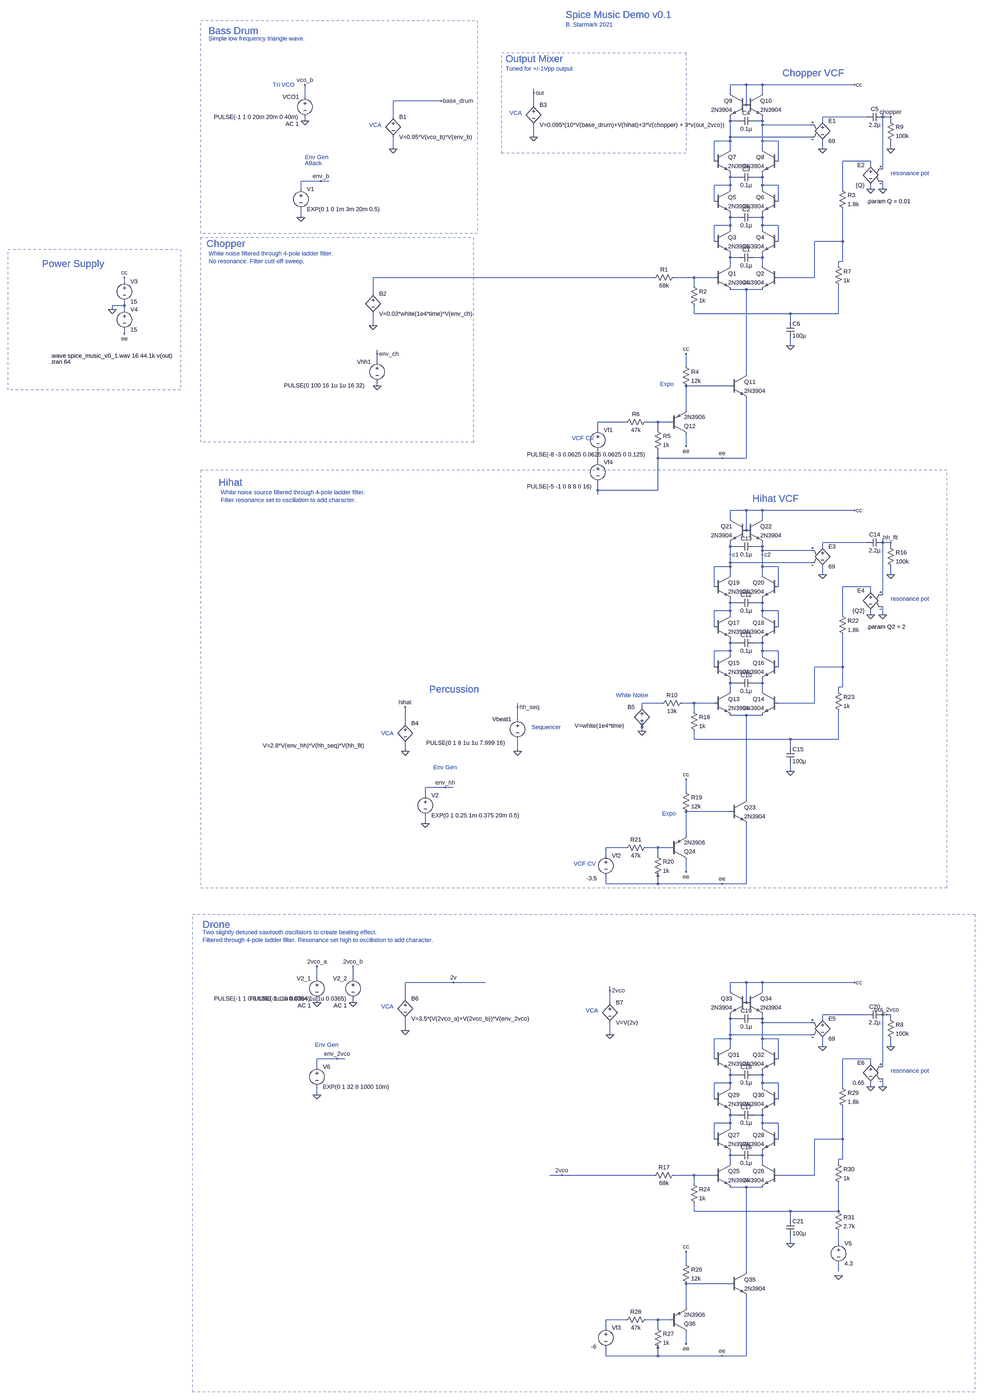
[diagram p0: schematic spice_music_v0_1.asc, whole sheet]
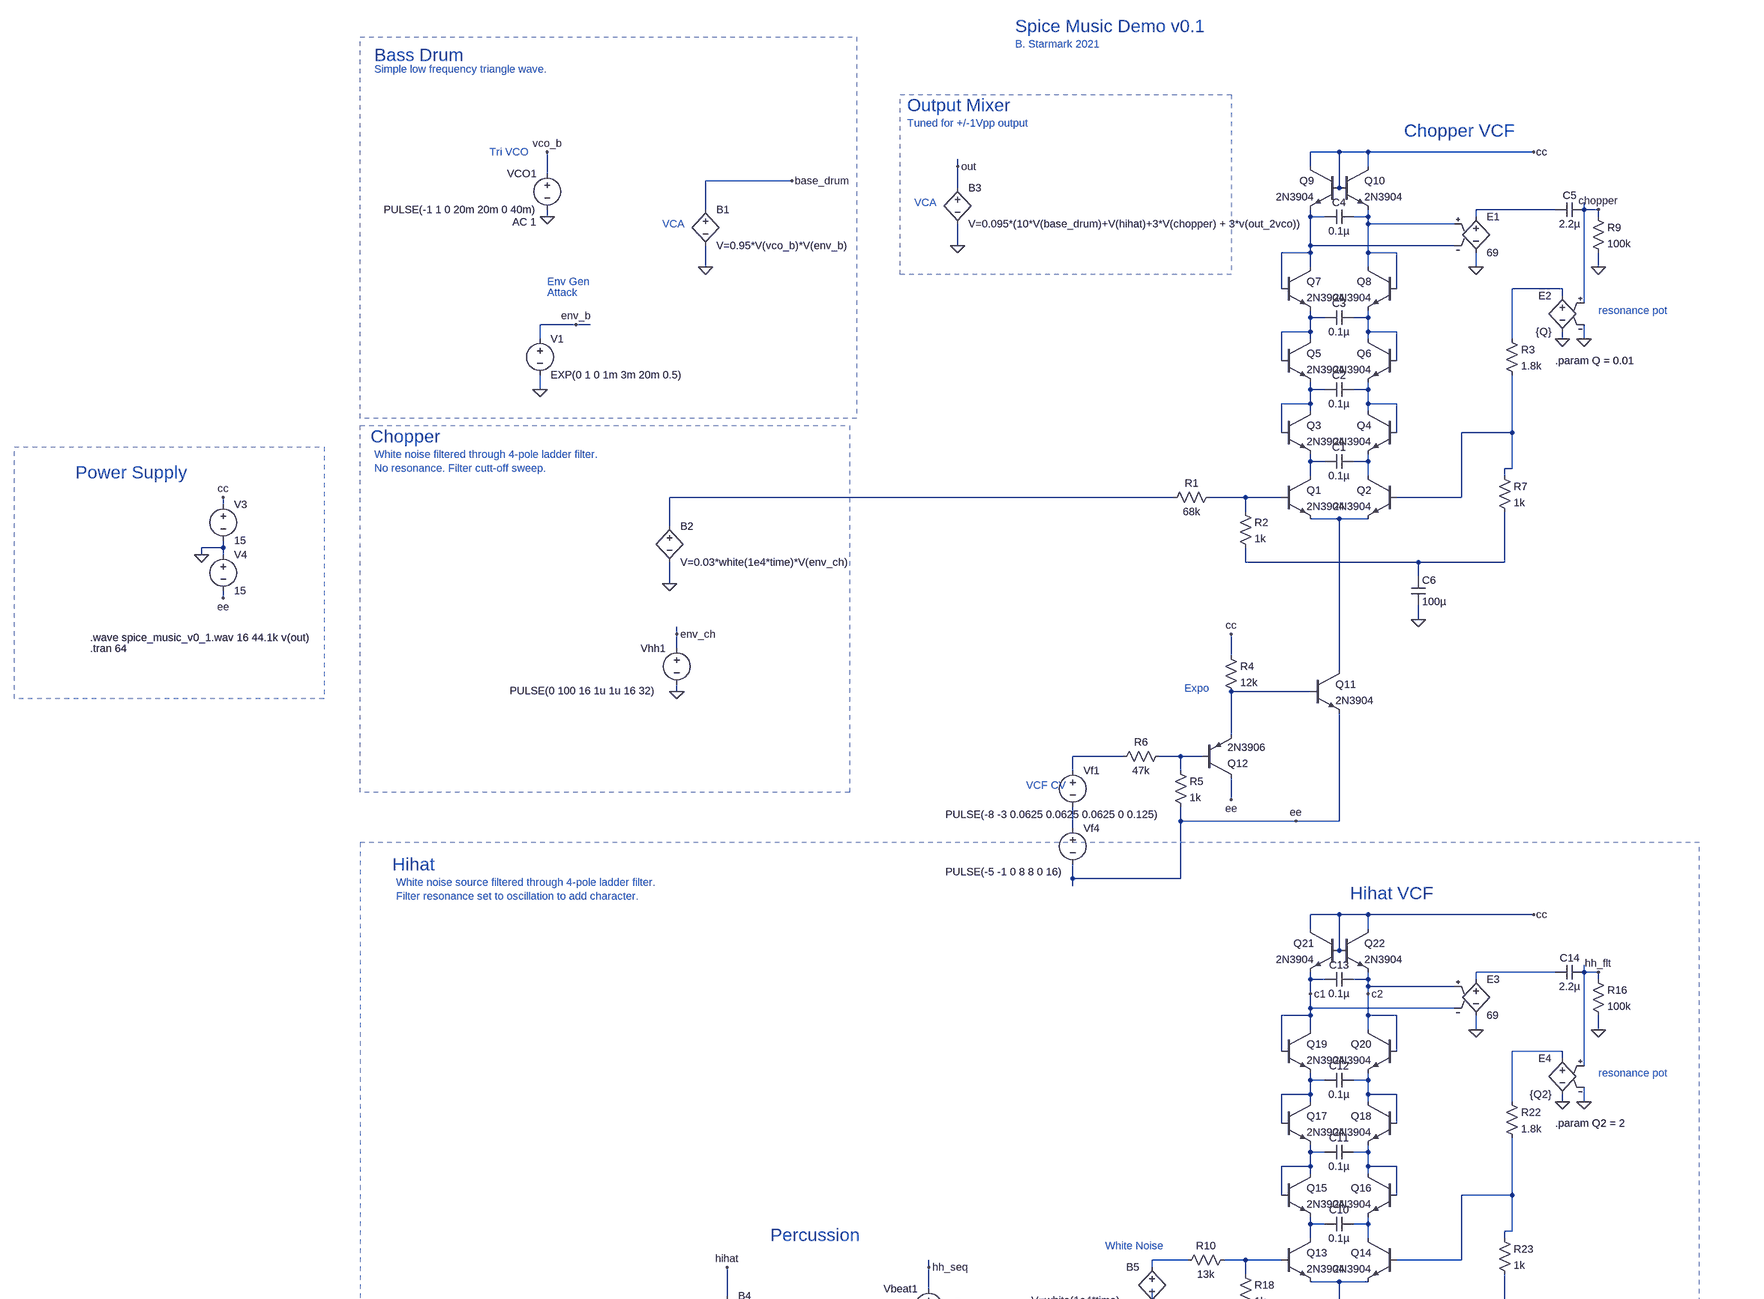
[diagram p1: schematic spice_music_v0_1.asc, part, row 1 of 2, column 1 of 1]
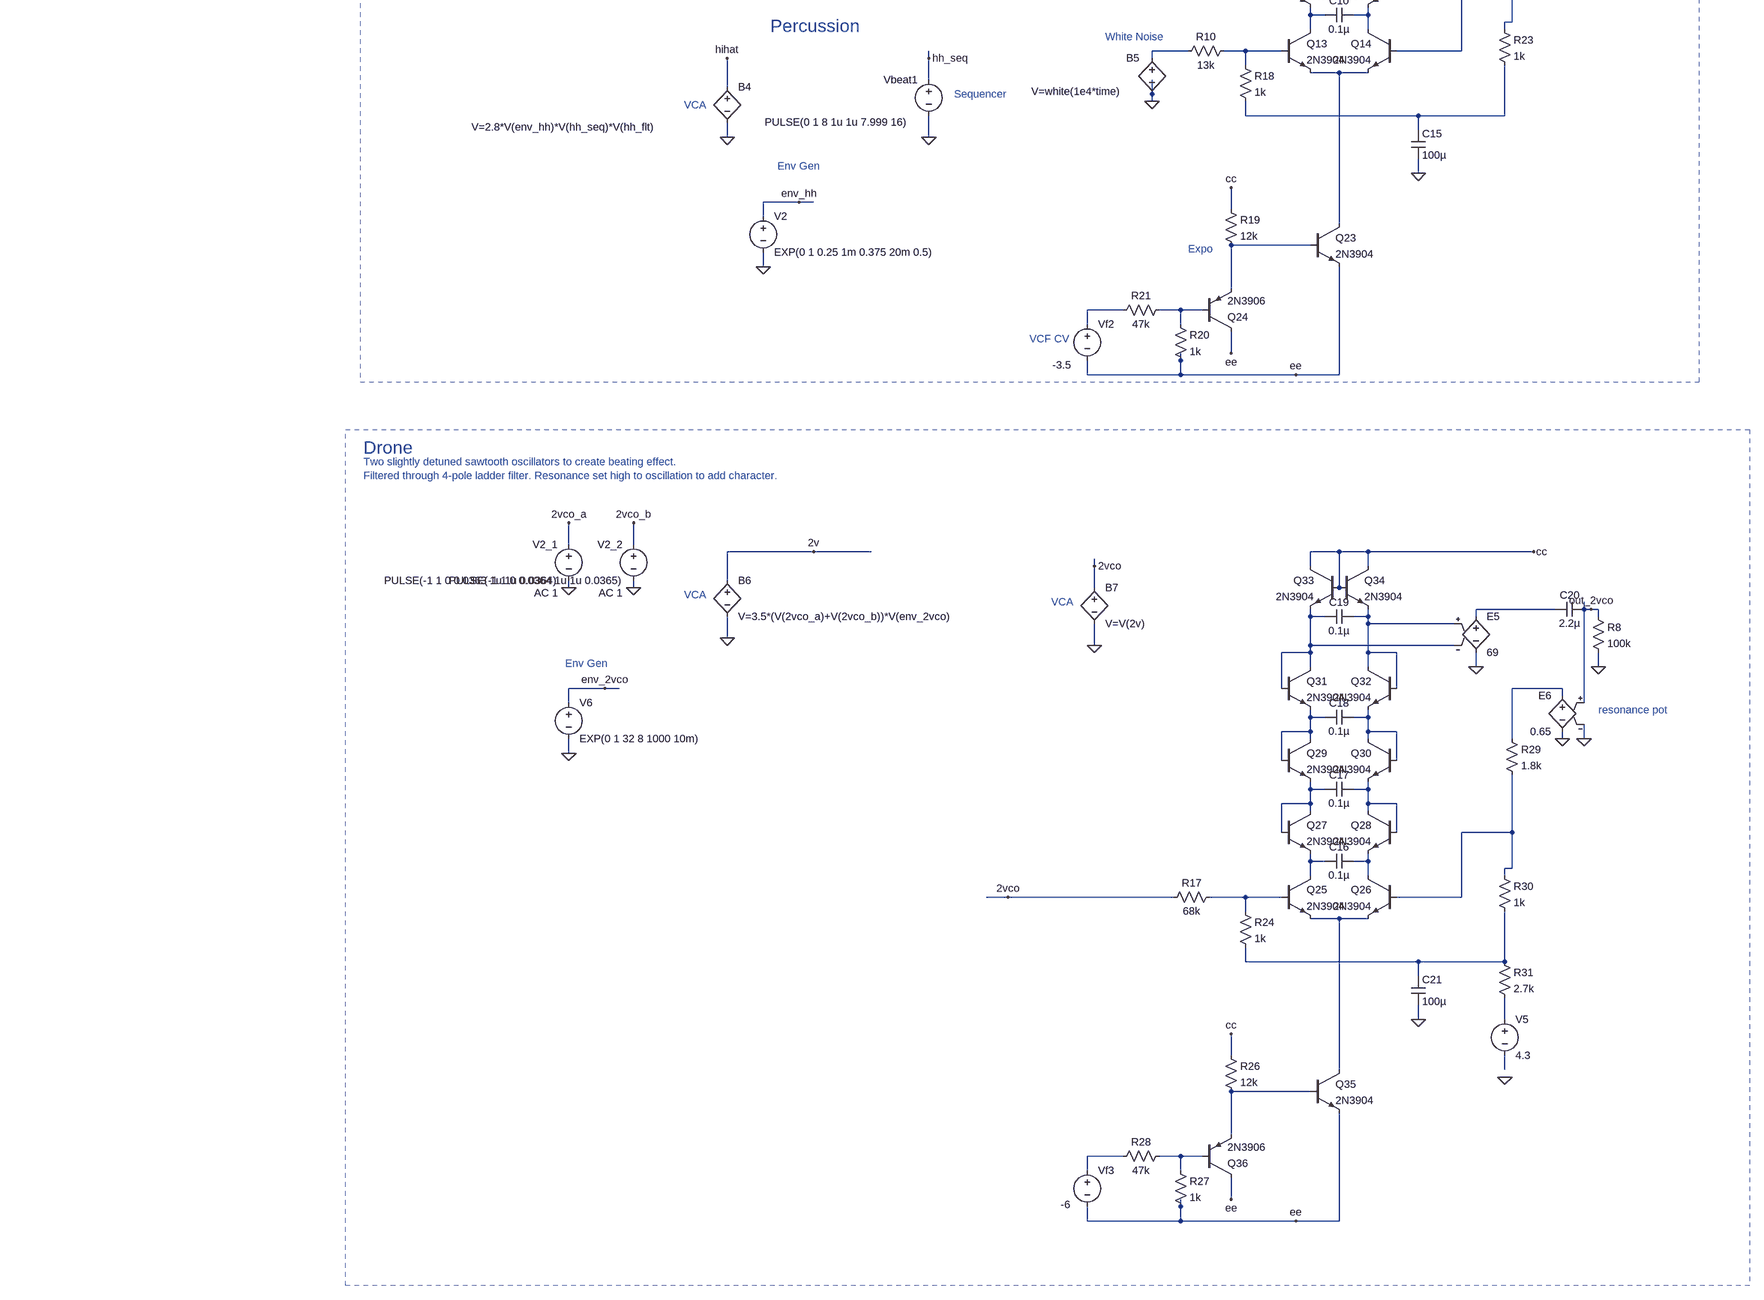
[diagram p2: schematic spice_music_v0_1.asc, part, row 2 of 2, column 1 of 1]
spice_music_v0_1.asc, the LTspice schematic file:
Version 4
SHEET 1 1536 5468
WIRE 272 -752 208 -752
WIRE 336 -752 272 -752
WIRE 704 -752 336 -752
WIRE -576 -720 -576 -736
WIRE 208 -720 208 -752
WIRE 336 -720 336 -752
WIRE -1488 -704 -1488 -752
WIRE -944 -688 -1136 -688
WIRE -576 -672 -576 -720
WIRE 272 -672 272 -752
WIRE -1136 -624 -1136 -688
WIRE 752 -624 576 -624
WIRE 816 -624 816 -640
WIRE 848 -624 816 -624
WIRE -1488 -608 -1488 -624
WIRE 208 -608 208 -624
WIRE 240 -608 208 -608
WIRE 336 -608 336 -624
WIRE 336 -608 304 -608
WIRE 576 -608 576 -624
WIRE 848 -608 848 -624
WIRE 336 -592 336 -608
WIRE 528 -592 336 -592
WIRE -576 -544 -576 -592
WIRE 208 -544 208 -608
WIRE 528 -544 208 -544
WIRE 208 -528 208 -544
WIRE 208 -528 144 -528
WIRE 336 -528 336 -592
WIRE 400 -528 336 -528
WIRE -1136 -496 -1136 -544
WIRE 208 -496 208 -528
WIRE 336 -496 336 -528
WIRE 576 -496 576 -528
WIRE 848 -496 848 -528
WIRE 144 -448 144 -528
WIRE 400 -448 400 -528
WIRE 768 -448 656 -448
WIRE 768 -432 768 -448
WIRE 816 -416 816 -624
WIRE 208 -384 208 -400
WIRE 240 -384 208 -384
WIRE 336 -384 336 -400
WIRE 336 -384 304 -384
WIRE -1424 -368 -1504 -368
WIRE -1392 -368 -1424 -368
WIRE 208 -352 208 -384
WIRE 208 -352 144 -352
WIRE 336 -352 336 -384
WIRE 400 -352 336 -352
WIRE -1504 -336 -1504 -368
WIRE 208 -336 208 -352
WIRE 336 -336 336 -352
WIRE 656 -336 656 -448
WIRE 768 -336 768 -352
WIRE 816 -336 816 -368
WIRE 144 -288 144 -352
WIRE 400 -288 400 -352
WIRE -1504 -224 -1504 -256
WIRE 208 -224 208 -240
WIRE 240 -224 208 -224
WIRE 336 -224 336 -240
WIRE 336 -224 304 -224
WIRE 208 -192 208 -224
WIRE 208 -192 144 -192
WIRE 336 -192 336 -224
WIRE 400 -192 336 -192
WIRE 208 -176 208 -192
WIRE 336 -176 336 -192
WIRE 144 -128 144 -192
WIRE 400 -128 400 -192
WIRE 656 -128 656 -256
WIRE 656 -128 544 -128
WIRE 208 -64 208 -80
WIRE 240 -64 208 -64
WIRE 336 -64 336 -80
WIRE 336 -64 304 -64
WIRE 656 -48 656 -128
WIRE 656 -48 640 -48
WIRE 208 -32 208 -64
WIRE 336 -32 336 -64
WIRE 640 -32 640 -48
WIRE -96 16 -1216 16
WIRE 64 16 -16 16
WIRE 144 16 64 16
WIRE 544 16 544 -128
WIRE 544 16 400 16
WIRE -2208 32 -2208 16
WIRE 64 48 64 16
WIRE 272 64 208 64
WIRE 336 64 272 64
WIRE -1216 80 -1216 16
WIRE -2208 128 -2208 112
WIRE -2208 128 -2256 128
WIRE -2256 144 -2256 128
WIRE -2208 144 -2208 128
WIRE 64 160 64 128
WIRE 448 160 64 160
WIRE 640 160 640 48
WIRE 640 160 448 160
WIRE 448 192 448 160
WIRE -1216 208 -1216 160
WIRE -2208 240 -2208 224
WIRE 448 288 448 256
WIRE -1200 320 -1200 304
WIRE -1200 352 -1200 320
WIRE 32 368 32 320
WIRE 272 400 272 64
WIRE -1200 448 -1200 432
WIRE 208 448 32 448
WIRE 32 544 32 448
WIRE -208 592 -320 592
WIRE -80 592 -128 592
WIRE -32 592 -80 592
WIRE -320 624 -320 592
WIRE -80 624 -80 592
WIRE 32 688 32 640
WIRE -80 736 -80 704
WIRE 176 736 -80 736
WIRE 272 736 272 496
WIRE 272 736 176 736
WIRE -320 752 -320 704
WIRE -320 864 -320 832
WIRE -80 864 -80 736
WIRE -80 864 -320 864
WIRE -320 880 -320 864
WIRE 272 944 208 944
WIRE 336 944 272 944
WIRE 704 944 336 944
WIRE 208 976 208 944
WIRE 336 976 336 944
WIRE 272 1024 272 944
WIRE 752 1072 576 1072
WIRE 816 1072 816 1056
WIRE 848 1072 816 1072
WIRE 208 1088 208 1072
WIRE 240 1088 208 1088
WIRE 336 1088 336 1072
WIRE 336 1088 304 1088
WIRE 576 1088 576 1072
WIRE 848 1088 848 1072
WIRE 336 1104 336 1088
WIRE 528 1104 336 1104
WIRE 208 1120 208 1088
WIRE 336 1120 336 1104
WIRE 208 1152 208 1120
WIRE 528 1152 208 1152
WIRE 208 1168 208 1152
WIRE 208 1168 144 1168
WIRE 336 1168 336 1120
WIRE 400 1168 336 1168
WIRE 208 1200 208 1168
WIRE 336 1200 336 1168
WIRE 576 1200 576 1168
WIRE 848 1200 848 1168
WIRE 144 1248 144 1168
WIRE 400 1248 400 1168
WIRE 768 1248 656 1248
WIRE 768 1264 768 1248
WIRE 816 1280 816 1072
WIRE 208 1312 208 1296
WIRE 240 1312 208 1312
WIRE 336 1312 336 1296
WIRE 336 1312 304 1312
WIRE 208 1344 208 1312
WIRE 208 1344 144 1344
WIRE 336 1344 336 1312
WIRE 400 1344 336 1344
WIRE 208 1360 208 1344
WIRE 336 1360 336 1344
WIRE 656 1360 656 1248
WIRE 768 1360 768 1344
WIRE 816 1360 816 1328
WIRE 144 1408 144 1344
WIRE 400 1408 400 1344
WIRE 208 1472 208 1456
WIRE 240 1472 208 1472
WIRE 336 1472 336 1456
WIRE 336 1472 304 1472
WIRE 208 1504 208 1472
WIRE 208 1504 144 1504
WIRE 336 1504 336 1472
WIRE 400 1504 336 1504
WIRE 208 1520 208 1504
WIRE 336 1520 336 1504
WIRE 144 1568 144 1504
WIRE 400 1568 400 1504
WIRE 656 1568 656 1440
WIRE 656 1568 544 1568
WIRE 208 1632 208 1616
WIRE 240 1632 208 1632
WIRE 336 1632 336 1616
WIRE 336 1632 304 1632
WIRE 656 1648 656 1568
WIRE 656 1648 640 1648
WIRE 208 1664 208 1632
WIRE 336 1664 336 1632
WIRE 640 1664 640 1648
WIRE -64 1712 -144 1712
WIRE 64 1712 16 1712
WIRE 144 1712 64 1712
WIRE 544 1712 544 1568
WIRE 544 1712 400 1712
WIRE -640 1728 -640 1712
WIRE -144 1728 -144 1712
WIRE 64 1744 64 1712
WIRE 272 1760 208 1760
WIRE 336 1760 272 1760
WIRE -640 1776 -640 1728
WIRE -1088 1792 -1088 1728
WIRE -144 1808 -144 1776
WIRE -144 1824 -144 1808
WIRE 64 1856 64 1824
WIRE 448 1856 64 1856
WIRE 640 1856 640 1744
WIRE 640 1856 448 1856
WIRE 448 1888 448 1856
WIRE -1088 1904 -1088 1872
WIRE -640 1904 -640 1856
WIRE 448 1984 448 1952
WIRE -928 2048 -1008 2048
WIRE -896 2048 -928 2048
WIRE 32 2064 32 2016
WIRE -1008 2080 -1008 2048
WIRE 272 2096 272 1760
WIRE 208 2144 32 2144
WIRE -1008 2192 -1008 2160
WIRE 32 2240 32 2144
WIRE -208 2288 -288 2288
WIRE -80 2288 -128 2288
WIRE -32 2288 -80 2288
WIRE -288 2320 -288 2288
WIRE -80 2320 -80 2288
WIRE 32 2384 32 2336
WIRE -80 2400 -80 2384
WIRE -288 2432 -288 2400
WIRE -80 2432 -80 2400
WIRE -80 2432 -288 2432
WIRE 176 2432 -80 2432
WIRE 272 2432 272 2192
WIRE 272 2432 176 2432
WIRE -1440 2816 -1440 2768
WIRE -1296 2816 -1296 2768
WIRE -896 2832 -1088 2832
WIRE -768 2832 -896 2832
WIRE 272 2832 208 2832
WIRE 336 2832 272 2832
WIRE 704 2832 336 2832
WIRE -272 2864 -272 2848
WIRE 208 2864 208 2832
WIRE 336 2864 336 2832
WIRE -1088 2896 -1088 2832
WIRE -1440 2912 -1440 2896
WIRE -1296 2912 -1296 2896
WIRE -272 2912 -272 2864
WIRE 272 2912 272 2832
WIRE 752 2960 576 2960
WIRE 816 2960 816 2944
WIRE 832 2960 816 2960
WIRE 848 2960 832 2960
WIRE 208 2976 208 2960
WIRE 240 2976 208 2976
WIRE 336 2976 336 2960
WIRE 336 2976 304 2976
WIRE 576 2976 576 2960
WIRE 848 2976 848 2960
WIRE 336 2992 336 2976
WIRE 528 2992 336 2992
WIRE -1088 3024 -1088 2976
WIRE -272 3040 -272 2992
WIRE 208 3040 208 2976
WIRE 528 3040 208 3040
WIRE 208 3056 208 3040
WIRE 208 3056 144 3056
WIRE 336 3056 336 2992
WIRE 400 3056 336 3056
WIRE 208 3088 208 3056
WIRE 336 3088 336 3056
WIRE 576 3088 576 3056
WIRE 848 3088 848 3056
WIRE -1360 3136 -1440 3136
WIRE -1328 3136 -1360 3136
WIRE 144 3136 144 3056
WIRE 400 3136 400 3056
WIRE 768 3136 656 3136
WIRE 768 3152 768 3136
WIRE -1440 3168 -1440 3136
WIRE 816 3168 816 2960
WIRE 208 3200 208 3184
WIRE 240 3200 208 3200
WIRE 336 3200 336 3184
WIRE 336 3200 304 3200
WIRE 208 3232 208 3200
WIRE 208 3232 144 3232
WIRE 336 3232 336 3200
WIRE 400 3232 336 3232
WIRE 208 3248 208 3232
WIRE 336 3248 336 3232
WIRE 656 3248 656 3136
WIRE 768 3248 768 3232
WIRE 816 3248 816 3216
WIRE -1440 3280 -1440 3248
WIRE 144 3296 144 3232
WIRE 400 3296 400 3232
WIRE 208 3360 208 3344
WIRE 240 3360 208 3360
WIRE 336 3360 336 3344
WIRE 336 3360 304 3360
WIRE 208 3392 208 3360
WIRE 208 3392 144 3392
WIRE 336 3392 336 3360
WIRE 400 3392 336 3392
WIRE 208 3408 208 3392
WIRE 336 3408 336 3392
WIRE 144 3456 144 3392
WIRE 400 3456 400 3392
WIRE 656 3456 656 3328
WIRE 656 3456 544 3456
WIRE 208 3520 208 3504
WIRE 240 3520 208 3520
WIRE 336 3520 336 3504
WIRE 336 3520 304 3520
WIRE 656 3536 656 3456
WIRE 656 3536 640 3536
WIRE 208 3552 208 3520
WIRE 336 3552 336 3520
WIRE 640 3552 640 3536
WIRE -464 3600 -512 3600
WIRE -96 3600 -464 3600
WIRE 64 3600 -16 3600
WIRE 144 3600 64 3600
WIRE 544 3600 544 3456
WIRE 544 3600 400 3600
WIRE 64 3632 64 3600
WIRE 272 3648 208 3648
WIRE 336 3648 272 3648
WIRE 64 3744 64 3712
WIRE 448 3744 64 3744
WIRE 640 3744 640 3632
WIRE 640 3744 448 3744
WIRE 448 3776 448 3744
WIRE 448 3872 448 3840
WIRE 640 3872 640 3824
WIRE 32 3952 32 3904
WIRE 272 3984 272 3648
WIRE 640 3984 640 3952
WIRE 208 4032 32 4032
WIRE 32 4128 32 4032
WIRE -208 4176 -288 4176
WIRE -80 4176 -128 4176
WIRE -32 4176 -80 4176
WIRE -288 4208 -288 4176
WIRE -80 4208 -80 4176
WIRE 32 4272 32 4224
WIRE -80 4288 -80 4272
WIRE -288 4320 -288 4288
WIRE -80 4320 -80 4288
WIRE -80 4320 -288 4320
WIRE 176 4320 -80 4320
WIRE 272 4320 272 4080
WIRE 272 4320 176 4320
FLAG -2256 144 0
FLAG -2208 240 ee
FLAG -2208 16 cc
FLAG 704 -752 cc
FLAG 848 -496 0
FLAG 576 -496 0
FLAG 32 320 cc
FLAG 32 688 ee
FLAG 176 736 ee
FLAG 816 -336 0
FLAG 768 -336 0
FLAG 448 288 0
FLAG -576 -544 0
FLAG -576 -720 out
FLAG 848 -624 chopper
FLAG 704 944 cc
FLAG 848 1200 0
FLAG 576 1200 0
FLAG 208 1120 c1
FLAG 336 1120 c2
FLAG 32 2016 cc
FLAG 32 2384 ee
FLAG 176 2432 ee
FLAG 816 1360 0
FLAG 768 1360 0
FLAG 448 1984 0
FLAG 848 1072 hh_flt
FLAG -1088 3024 0
FLAG 704 2832 cc
FLAG 848 3088 0
FLAG 576 3088 0
FLAG 32 3904 cc
FLAG 32 4272 ee
FLAG 176 4320 ee
FLAG 816 3248 0
FLAG 768 3248 0
FLAG 640 4000 0
FLAG 448 3872 0
FLAG -1440 2768 2vco_a
FLAG -896 2832 2v
FLAG -272 3040 0
FLAG -1296 2912 0
FLAG -1296 2768 2vco_b
FLAG -1440 2912 0
FLAG 832 2960 out_2vco
FLAG -272 2864 2vco
FLAG -464 3600 2vco
FLAG -1200 448 0
FLAG -1216 208 0
FLAG -1200 320 env_ch
FLAG -1488 -608 0
FLAG -1136 -496 0
FLAG -1488 -752 vco_b
FLAG -944 -688 base_drum
FLAG -1504 -224 0
FLAG -1424 -368 env_b
FLAG -1088 1728 hihat
FLAG -640 1904 0
FLAG -640 1728 hh_seq
FLAG -1088 1904 0
FLAG -1008 2192 0
FLAG -928 2048 env_hh
FLAG -144 1824 0
FLAG -1440 3280 0
FLAG -1360 3136 env_2vco
SYMBOL voltage -2208 16 R0
SYMATTR InstName V3
SYMATTR Value 15
SYMBOL voltage -2208 128 R0
SYMATTR InstName V4
SYMATTR Value 15
SYMBOL npn 144 -32 R0
SYMATTR InstName Q1
SYMATTR Value 2N3904
SYMBOL npn 400 -32 M0
SYMATTR InstName Q2
SYMATTR Value 2N3904
SYMBOL cap 304 -80 R90
WINDOW 0 0 32 VBottom 2
WINDOW 3 32 32 VTop 2
SYMATTR InstName C1
SYMATTR Value 0.1µ
SYMBOL npn 144 -176 R0
SYMATTR InstName Q3
SYMATTR Value 2N3904
SYMBOL npn 400 -176 M0
SYMATTR InstName Q4
SYMATTR Value 2N3904
SYMBOL cap 304 -240 R90
WINDOW 0 0 32 VBottom 2
WINDOW 3 32 32 VTop 2
SYMATTR InstName C2
SYMATTR Value 0.1µ
SYMBOL npn 144 -336 R0
SYMATTR InstName Q5
SYMATTR Value 2N3904
SYMBOL npn 400 -336 M0
SYMATTR InstName Q6
SYMATTR Value 2N3904
SYMBOL cap 304 -400 R90
WINDOW 0 0 32 VBottom 2
WINDOW 3 32 32 VTop 2
SYMATTR InstName C3
SYMATTR Value 0.1µ
SYMBOL npn 144 -496 R0
SYMATTR InstName Q7
SYMATTR Value 2N3904
SYMBOL npn 400 -496 M0
SYMATTR InstName Q8
SYMATTR Value 2N3904
SYMBOL cap 304 -624 R90
WINDOW 0 0 32 VBottom 2
WINDOW 3 32 32 VTop 2
SYMATTR InstName C4
SYMATTR Value 0.1µ
SYMBOL npn 272 -720 M0
SYMATTR InstName Q9
SYMATTR Value 2N3904
SYMBOL npn 272 -720 R0
SYMATTR InstName Q10
SYMATTR Value 2N3904
SYMBOL cap 752 -608 R270
WINDOW 0 32 32 VTop 2
WINDOW 3 0 32 VBottom 2
SYMATTR InstName C5
SYMATTR Value 2.2µ
SYMBOL res 832 -624 R0
SYMATTR InstName R9
SYMATTR Value 100k
SYMBOL e 576 -624 R0
SYMATTR InstName E1
SYMATTR Value 69
SYMBOL res 0 0 R90
WINDOW 0 0 56 VBottom 2
WINDOW 3 32 56 VTop 2
SYMATTR InstName R1
SYMATTR Value 68k
SYMBOL res 48 32 R0
SYMATTR InstName R2
SYMATTR Value 1k
SYMBOL npn 208 400 R0
SYMATTR InstName Q11
SYMATTR Value 2N3904
SYMBOL pnp -32 640 M180
SYMATTR InstName Q12
SYMATTR Value 2N3906
SYMBOL res 16 352 R0
SYMATTR InstName R4
SYMATTR Value 12k
SYMBOL res -96 608 R0
SYMATTR InstName R5
SYMATTR Value 1k
SYMBOL res -112 576 R90
WINDOW 0 0 56 VBottom 2
WINDOW 3 32 56 VTop 2
SYMATTR InstName R6
SYMATTR Value 47k
SYMBOL e 768 -448 M0
SYMATTR InstName E2
SYMATTR Value {Q}
SYMBOL res 640 -352 R0
SYMATTR InstName R3
SYMATTR Value 1.8k
SYMBOL res 624 -48 R0
SYMATTR InstName R7
SYMATTR Value 1k
SYMBOL cap 432 192 R0
SYMATTR InstName C6
SYMATTR Value 100µ
SYMBOL bv -576 -688 R0
SYMATTR InstName B3
SYMATTR Value V=0.095*(10*V(base_drum)+V(hihat)+3*V(chopper) + 3*v(out_2vco))
SYMBOL npn 144 1664 R0
SYMATTR InstName Q13
SYMATTR Value 2N3904
SYMBOL npn 400 1664 M0
SYMATTR InstName Q14
SYMATTR Value 2N3904
SYMBOL cap 304 1616 R90
WINDOW 0 0 32 VBottom 2
WINDOW 3 32 32 VTop 2
SYMATTR InstName C10
SYMATTR Value 0.1µ
SYMBOL npn 144 1520 R0
SYMATTR InstName Q15
SYMATTR Value 2N3904
SYMBOL npn 400 1520 M0
SYMATTR InstName Q16
SYMATTR Value 2N3904
SYMBOL cap 304 1456 R90
WINDOW 0 0 32 VBottom 2
WINDOW 3 32 32 VTop 2
SYMATTR InstName C11
SYMATTR Value 0.1µ
SYMBOL npn 144 1360 R0
SYMATTR InstName Q17
SYMATTR Value 2N3904
SYMBOL npn 400 1360 M0
SYMATTR InstName Q18
SYMATTR Value 2N3904
SYMBOL cap 304 1296 R90
WINDOW 0 0 32 VBottom 2
WINDOW 3 32 32 VTop 2
SYMATTR InstName C12
SYMATTR Value 0.1µ
SYMBOL npn 144 1200 R0
SYMATTR InstName Q19
SYMATTR Value 2N3904
SYMBOL npn 400 1200 M0
SYMATTR InstName Q20
SYMATTR Value 2N3904
SYMBOL cap 304 1072 R90
WINDOW 0 0 32 VBottom 2
WINDOW 3 32 32 VTop 2
SYMATTR InstName C13
SYMATTR Value 0.1µ
SYMBOL npn 272 976 M0
SYMATTR InstName Q21
SYMATTR Value 2N3904
SYMBOL npn 272 976 R0
SYMATTR InstName Q22
SYMATTR Value 2N3904
SYMBOL cap 752 1088 R270
WINDOW 0 32 32 VTop 2
WINDOW 3 0 32 VBottom 2
SYMATTR InstName C14
SYMATTR Value 2.2µ
SYMBOL res 832 1072 R0
SYMATTR InstName R16
SYMATTR Value 100k
SYMBOL e 576 1072 R0
SYMATTR InstName E3
SYMATTR Value 69
SYMBOL res 48 1728 R0
SYMATTR InstName R18
SYMATTR Value 1k
SYMBOL npn 208 2096 R0
SYMATTR InstName Q23
SYMATTR Value 2N3904
SYMBOL pnp -32 2336 M180
SYMATTR InstName Q24
SYMATTR Value 2N3906
SYMBOL res 16 2048 R0
SYMATTR InstName R19
SYMATTR Value 12k
SYMBOL res -96 2304 R0
SYMATTR InstName R20
SYMATTR Value 1k
SYMBOL res -112 2272 R90
WINDOW 0 0 56 VBottom 2
WINDOW 3 32 56 VTop 2
SYMATTR InstName R21
SYMATTR Value 47k
SYMBOL e 768 1248 M0
SYMATTR InstName E4
SYMATTR Value {Q2}
SYMBOL res 640 1344 R0
SYMATTR InstName R22
SYMATTR Value 1.8k
SYMBOL res 624 1648 R0
SYMATTR InstName R23
SYMATTR Value 1k
SYMBOL cap 432 1888 R0
SYMATTR InstName C15
SYMATTR Value 100µ
SYMBOL voltage -288 2304 R0
WINDOW 123 0 0 Left 0
WINDOW 39 0 0 Left 0
WINDOW 3 -77 106 Left 2
SYMATTR Value -3.5
SYMATTR InstName Vf2
SYMBOL bv -1088 2880 R0
SYMATTR InstName B6
SYMATTR Value V=3.5*(V(2vco_a)+V(2vco_b))*V(env_2vco)
SYMBOL npn 144 3552 R0
SYMATTR InstName Q25
SYMATTR Value 2N3904
SYMBOL npn 400 3552 M0
SYMATTR InstName Q26
SYMATTR Value 2N3904
SYMBOL cap 304 3504 R90
WINDOW 0 0 32 VBottom 2
WINDOW 3 32 32 VTop 2
SYMATTR InstName C16
SYMATTR Value 0.1µ
SYMBOL npn 144 3408 R0
SYMATTR InstName Q27
SYMATTR Value 2N3904
SYMBOL npn 400 3408 M0
SYMATTR InstName Q28
SYMATTR Value 2N3904
SYMBOL cap 304 3344 R90
WINDOW 0 0 32 VBottom 2
WINDOW 3 32 32 VTop 2
SYMATTR InstName C17
SYMATTR Value 0.1µ
SYMBOL npn 144 3248 R0
SYMATTR InstName Q29
SYMATTR Value 2N3904
SYMBOL npn 400 3248 M0
SYMATTR InstName Q30
SYMATTR Value 2N3904
SYMBOL cap 304 3184 R90
WINDOW 0 0 32 VBottom 2
WINDOW 3 32 32 VTop 2
SYMATTR InstName C18
SYMATTR Value 0.1µ
SYMBOL npn 144 3088 R0
SYMATTR InstName Q31
SYMATTR Value 2N3904
SYMBOL npn 400 3088 M0
SYMATTR InstName Q32
SYMATTR Value 2N3904
SYMBOL cap 304 2960 R90
WINDOW 0 0 32 VBottom 2
WINDOW 3 32 32 VTop 2
SYMATTR InstName C19
SYMATTR Value 0.1µ
SYMBOL npn 272 2864 M0
SYMATTR InstName Q33
SYMATTR Value 2N3904
SYMBOL npn 272 2864 R0
SYMATTR InstName Q34
SYMATTR Value 2N3904
SYMBOL cap 752 2976 R270
WINDOW 0 32 32 VTop 2
WINDOW 3 0 32 VBottom 2
SYMATTR InstName C20
SYMATTR Value 2.2µ
SYMBOL res 832 2960 R0
SYMATTR InstName R8
SYMATTR Value 100k
SYMBOL e 576 2960 R0
SYMATTR InstName E5
SYMATTR Value 69
SYMBOL res 0 3584 R90
WINDOW 0 0 56 VBottom 2
WINDOW 3 32 56 VTop 2
SYMATTR InstName R17
SYMATTR Value 68k
SYMBOL res 48 3616 R0
SYMATTR InstName R24
SYMATTR Value 1k
SYMBOL npn 208 3984 R0
SYMATTR InstName Q35
SYMATTR Value 2N3904
SYMBOL pnp -32 4224 M180
SYMATTR InstName Q36
SYMATTR Value 2N3906
SYMBOL res 16 3936 R0
SYMATTR InstName R26
SYMATTR Value 12k
SYMBOL res -96 4192 R0
SYMATTR InstName R27
SYMATTR Value 1k
SYMBOL res -112 4160 R90
WINDOW 0 0 56 VBottom 2
WINDOW 3 32 56 VTop 2
SYMATTR InstName R28
SYMATTR Value 47k
SYMBOL e 768 3136 M0
SYMATTR InstName E6
SYMATTR Value 0.65
SYMBOL res 640 3232 R0
SYMATTR InstName R29
SYMATTR Value 1.8k
SYMBOL res 624 3536 R0
SYMATTR InstName R30
SYMATTR Value 1k
SYMBOL res 624 3728 R0
SYMATTR InstName R31
SYMATTR Value 2.7k
SYMBOL voltage 640 3856 R0
SYMATTR InstName V5
SYMATTR Value 4.3
SYMBOL cap 432 3776 R0
SYMATTR InstName C21
SYMATTR Value 100µ
SYMBOL bv -272 2896 R0
SYMATTR InstName B7
SYMATTR Value V=V(2v)
SYMBOL voltage -1296 2800 M0
WINDOW 123 24 124 Left 2
WINDOW 39 0 0 Left 2
SYMATTR Value2 AC 1
SYMATTR InstName V2_2
SYMATTR Value PULSE(-1 1 0 0.0364 1u 1u 0.0365)
SYMBOL voltage -1440 2800 M0
WINDOW 123 24 124 Left 2
WINDOW 39 0 0 Left 2
SYMATTR Value2 AC 1
SYMATTR InstName V2_1
SYMATTR Value PULSE(-1 1 0 0.0363 1u 1u 0.0364)
SYMBOL voltage -288 4192 R0
WINDOW 123 0 0 Left 0
WINDOW 39 0 0 Left 0
WINDOW 3 -59 92 Left 2
SYMATTR Value -6
SYMATTR InstName Vf3
SYMBOL voltage -1200 336 M0
WINDOW 123 24 124 Left 2
WINDOW 39 0 0 Left 2
WINDOW 3 47 110 Left 2
SYMATTR Value PULSE(0 100 16 1u 1u 16 32)
SYMATTR InstName Vhh1
SYMBOL bv -1216 64 R0
SYMATTR InstName B2
SYMATTR Value V=0.03*white(1e4*time)*V(env_ch)
SYMBOL voltage -320 608 R0
WINDOW 123 0 0 Left 0
WINDOW 39 0 0 Left 0
WINDOW 3 -283 113 Left 2
SYMATTR Value PULSE(-8 -3 0.0625 0.0625 0.0625 0 0.125)
SYMATTR InstName Vf1
SYMBOL voltage -320 736 R0
WINDOW 123 0 0 Left 0
WINDOW 39 0 0 Left 0
WINDOW 3 -283 113 Left 2
SYMATTR Value PULSE(-5 -1 0 8 8 0 16)
SYMATTR InstName Vf4
SYMBOL voltage -1488 -720 M0
WINDOW 123 24 124 Left 2
WINDOW 39 0 0 Left 2
SYMATTR Value2 AC 1
SYMATTR InstName VCO1
SYMATTR Value PULSE(-1 1 0 20m 20m 0 40m)
SYMBOL bv -1136 -640 R0
SYMATTR InstName B1
SYMATTR Value V=0.95*V(vco_b)*V(env_b)
SYMBOL voltage -1504 -352 R0
WINDOW 123 0 0 Left 0
WINDOW 39 0 0 Left 0
SYMATTR InstName V1
SYMATTR Value EXP(0 1 0 1m 3m 20m 0.5)
SYMBOL bv -1088 1776 R0
WINDOW 3 -568 105 Left 2
SYMATTR Value V=2.8*V(env_hh)*V(hh_seq)*V(hh_flt)
SYMATTR InstName B4
SYMBOL voltage -640 1760 M0
WINDOW 123 24 124 Left 2
WINDOW 39 0 0 Left 2
WINDOW 3 47 110 Left 2
SYMATTR Value PULSE(0 1 8 1u 1u 7.999 16)
SYMATTR InstName Vbeat1
SYMBOL voltage -1008 2064 R0
WINDOW 123 0 0 Left 0
WINDOW 39 0 0 Left 0
SYMATTR InstName V2
SYMATTR Value EXP(0 1 0.25 1m 0.375 20m 0.5)
SYMBOL res 32 1696 R90
WINDOW 0 0 56 VBottom 2
WINDOW 3 32 56 VTop 2
SYMATTR InstName R10
SYMATTR Value 13k
SYMBOL bv -144 1712 R0
WINDOW 0 -57 16 Left 2
WINDOW 3 -268 90 Left 2
SYMATTR InstName B5
SYMATTR Value V=white(1e4*time)
SYMBOL voltage -1440 3152 R0
WINDOW 123 0 0 Left 0
WINDOW 39 0 0 Left 0
SYMATTR InstName V6
SYMATTR Value EXP(0 1 32 8 1000 10m)
TEXT -2504 352 Left 2 !.tran 64
TEXT -448 -1032 Left 4 ;Spice Music Demo v0.1
TEXT -2504 328 Left 2 !.wave spice_music_v0_1.wav 16 44.1k v(out)
TEXT 848 -400 Left 2 ;resonance pot
TEXT 752 -288 Left 2 !.param Q = 0.01
TEXT -448 -992 Left 2 ;B. Starmark 2021
TEXT -1872 -968 Left 4 ;Bass Drum
TEXT -1880 -120 Left 4 ;Chopper
TEXT -672 -640 Left 2 ;VCA
TEXT 416 -800 Left 4 ;Chopper VCF
TEXT 848 1296 Left 2 ;resonance pot
TEXT 752 1408 Left 2 !.param Q2 = 2
TEXT -2536 -40 Left 4 ;Power Supply
TEXT 296 896 Left 4 ;Hihat VCF
TEXT -1832 832 Left 4 ;Hihat
TEXT -688 -856 Left 4 ;Output Mixer
TEXT -72 440 Left 2 ;Expo
TEXT -64 2152 Left 2 ;Expo
TEXT -416 2352 Left 2 ;VCF CV
TEXT 848 3184 Left 2 ;resonance pot
TEXT -1184 2928 Left 2 ;VCA
TEXT -368 2944 Left 2 ;VCA
TEXT -1896 2600 Left 4 ;Drone
TEXT -1824 872 Left 2 ;White noise source filtered through 4-pole ladder filter.\nFilter resonance set to oscillation to add character.
TEXT -1872 -936 Left 2 ;Simple low frequency triangle wave.
TEXT -1872 -80 Left 2 ;White noise filtered through 4-pole ladder filter.\nNo resonance. Filter cutt-off sweep.
TEXT -1896 2632 Left 2 ;Two slightly detuned sawtooth oscillators to create beating effect.\nFiltered through 4-pole ladder filter. Resonance set high to oscillation to add character.
TEXT -688 -816 Left 2 ;Tuned for +/-1Vpp output
TEXT -424 656 Left 2 ;VCF CV
TEXT -1488 -440 Left 2 ;Attack
TEXT -1232 -592 Left 2 ;VCA
TEXT -1488 -464 Left 2 ;Env Gen
TEXT -1616 -752 Left 2 ;Tri VCO
TEXT -976 1968 Left 2 ;Env Gen
TEXT -992 1656 Left 4 ;Percussion
TEXT -584 1808 Left 2 ;Sequencer
TEXT -1184 1832 Left 2 ;VCA
TEXT -248 1680 Left 2 ;White Noise
TEXT -1448 3080 Left 2 ;Env Gen
RECTANGLE Normal -800 -160 -1904 -1008 2
RECTANGLE Normal -816 672 -1904 -144 2
RECTANGLE Normal -1984 464 -2672 -96 2
RECTANGLE Normal 32 -480 -704 -880 2
RECTANGLE Normal -1904 2448 1072 784 2
RECTANGLE Normal 1184 4464 -1936 2560 2

The netlist it stands for:
* spice_music_v0_1.asc
V3 cc 0 15
V4 0 ee 15
Q1 N010 N013 N014 0 2N3904
Q2 N011 N009 N014 0 2N3904
C1 N011 N010 0.1µ
Q3 N007 N007 N010 0 2N3904
Q4 N008 N008 N011 0 2N3904
C2 N008 N007 0.1µ
Q5 N005 N005 N007 0 2N3904
Q6 N006 N006 N008 0 2N3904
C3 N006 N005 0.1µ
Q7 N002 N002 N005 0 2N3904
Q8 N003 N003 N006 0 2N3904
C4 N003 N002 0.1µ
Q9 cc cc N002 0 2N3904
Q10 cc cc N003 0 2N3904
C5 N001 chopper 2.2µ
R9 chopper 0 100k
E1 N001 0 N003 N002 69
R1 N013 N012 68k
R2 N013 N015 1k
Q11 N014 N016 ee 0 2N3904
Q12 ee N018 N016 0 2N3906
R4 cc N016 12k
R5 N018 ee 1k
R6 N018 N017 47k
E2 N004 0 chopper 0 {Q}
R3 N004 N009 1.8k
R7 N009 N015 1k
C6 N015 0 100µ
B3 out 0 V=0.095*(10*V(base_drum)+V(hihat)+3*V(chopper) + 3*v(out_2vco))
Q13 N027 N030 N031 0 2N3904
Q14 N028 N026 N031 0 2N3904
C10 N028 N027 0.1µ
Q15 N024 N024 N027 0 2N3904
Q16 N025 N025 N028 0 2N3904
C11 N025 N024 0.1µ
Q17 N022 N022 N024 0 2N3904
Q18 N023 N023 N025 0 2N3904
C12 N023 N022 0.1µ
Q19 c1 c1 N022 0 2N3904
Q20 c2 c2 N023 0 2N3904
C13 c2 c1 0.1µ
Q21 cc cc c1 0 2N3904
Q22 cc cc c2 0 2N3904
C14 N020 hh_flt 2.2µ
R16 hh_flt 0 100k
E3 N020 0 c2 c1 69
R18 N030 N032 1k
Q23 N031 N033 ee 0 2N3904
Q24 ee N035 N033 0 2N3906
R19 cc N033 12k
R20 N035 ee 1k
R21 N035 N034 47k
E4 N021 0 hh_flt 0 {Q2}
R22 N021 N026 1.8k
R23 N026 N032 1k
C15 N032 0 100µ
Vf2 N034 ee -3.5
B6 2v 0 V=3.5*(V(2vco_a)+V(2vco_b))*V(env_2vco)
Q25 N045 N047 N048 0 2N3904
Q26 N046 N044 N048 0 2N3904
C16 N046 N045 0.1µ
Q27 N042 N042 N045 0 2N3904
Q28 N043 N043 N046 0 2N3904
C17 N043 N042 0.1µ
Q29 N040 N040 N042 0 2N3904
Q30 N041 N041 N043 0 2N3904
C18 N041 N040 0.1µ
Q31 N037 N037 N040 0 2N3904
Q32 N038 N038 N041 0 2N3904
C19 N038 N037 0.1µ
Q33 cc cc N037 0 2N3904
Q34 cc cc N038 0 2N3904
C20 N036 out_2vco 2.2µ
R8 out_2vco 0 100k
E5 N036 0 N038 N037 69
R17 N047 2vco 68k
R24 N047 N049 1k
Q35 N048 N052 ee 0 2N3904
Q36 ee N054 N052 0 2N3906
R26 cc N052 12k
R27 N054 ee 1k
R28 N054 N053 47k
E6 N039 0 out_2vco 0 0.65
R29 N039 N044 1.8k
R30 N044 N049 1k
R31 N049 N050 2.7k
V5 N050 N051 4.3
C21 N049 0 100µ
B7 2vco 0 V=V(2v)
V2_2 2vco_b 0 PULSE(-1 1 0 0.0364 1u 1u 0.0365) AC 1
V2_1 2vco_a 0 PULSE(-1 1 0 0.0363 1u 1u 0.0364) AC 1
Vf3 N053 ee -6
Vhh1 env_ch 0 PULSE(0 100 16 1u 1u 16 32)
B2 N012 0 V=0.03*white(1e4*time)*V(env_ch)
Vf1 N017 N019 PULSE(-8 -3 0.0625 0.0625 0.0625 0 0.125)
Vf4 N019 ee PULSE(-5 -1 0 8 8 0 16)
VCO1 vco_b 0 PULSE(-1 1 0 20m 20m 0 40m) AC 1
B1 base_drum 0 V=0.95*V(vco_b)*V(env_b)
V1 env_b 0 EXP(0 1 0 1m 3m 20m 0.5)
B4 hihat 0 V=2.8*V(env_hh)*V(hh_seq)*V(hh_flt)
Vbeat1 hh_seq 0 PULSE(0 1 8 1u 1u 7.999 16)
V2 env_hh 0 EXP(0 1 0.25 1m 0.375 20m 0.5)
R10 N030 N029 13k
B5 N029 0 V=white(1e4*time)
V6 env_2vco 0 EXP(0 1 32 8 1000 10m)
.model NPN NPN
.model PNP PNP
.lib standard.bjt
.tran 64
* Spice Music Demo v0.1
.wave spice_music_v0_1.wav 16 44.1k v(out)
* resonance pot
.param Q = 0.01
* B. Starmark 2021
* Bass Drum
* Chopper
* VCA
* Chopper VCF
* resonance pot
.param Q2 = 2
* Power Supply
* Hihat VCF
* Hihat
* Output Mixer
* Expo
* Expo
* VCF CV
* resonance pot
* VCA
* VCA
* Drone
* White noise source filtered through 4-pole ladder filter.
* Filter resonance set to oscillation to add character.
* Simple low frequency triangle wave.
* White noise filtered through 4-pole ladder filter.
* No resonance. Filter cutt-off sweep.
* Two slightly detuned sawtooth oscillators to create beating effect.
* Filtered through 4-pole ladder filter. Resonance set high to oscillation to add character.
* Tuned for +/-1Vpp output
* VCF CV
* Attack
* VCA
* Env Gen
* Tri VCO
* Env Gen
* Percussion
* Sequencer
* VCA
* White Noise
* Env Gen
.backanno
.end